# Altium schematic sheet [03] - AMG.SchDoc
size Letter
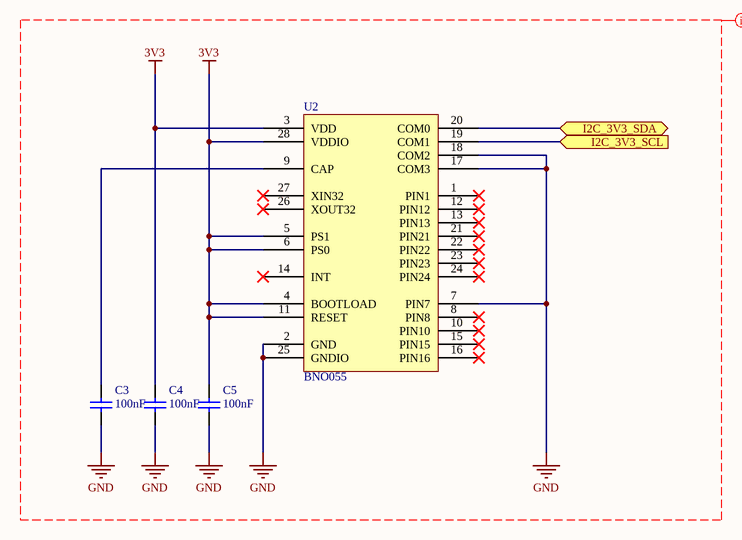
[diagram p0: [03] - AMG.SchDoc]

## Parts
C3  value 100nF  [CAPC0603(1608)100_L]  (hidden comment: CAP 100nF 50V 0603(1608))
C4  value 100nF  [CAPC0603(1608)100_L]  (hidden comment: CAP 100nF 50V 0603(1608))
C5  value 100nF  [CAPC0603(1608)100_L]  (hidden comment: CAP 100nF 50V 0603(1608))
U2  BNO055  [BNO055]

## Ports
I2C_3V3_SCL (in), I2C_3V3_SDA (bidir)

## Nets
3V3: C4.2 C5.2 U2.3(VDD) U2.4(BOOTLOAD) U2.5(PS1) U2.6(PS0) U2.11(RESET) U2.28(VDDIO)
GND: C3.1 C4.1 C5.1 U2.2(GND) U2.7(PIN7) U2.17(COM3) U2.18(COM2) U2.25(GNDIO)
I2C_3V3_SCL: U2.19(COM1) ; port I2C_3V3_SCL
I2C_3V3_SDA: U2.20(COM0) ; port I2C_3V3_SDA
NetC3_2: C3.2 U2.9(CAP)

Not connected (* = marked no-connect by the designer): U2 1(PIN1)* 8(PIN8)* 10(PIN10)* 12(PIN12)* 13(PIN13)* 14(INT)* 15(PIN15)* 16(PIN16)* 21(PIN21)* 22(PIN22)* 23(PIN23)* 24(PIN24)* 26(XOUT32)* 27(XIN32)*

## Layout directives
net class IMU Sensor: 3V3, GND

## Library data of the parts
C3-C5 = CMP-1035-02592-1: CAP 100nF 50V ±10% 0603 (1608 Metric) Thickness 1mm SMD; Manufacturer Part Number: C0603C104K5RACAUTO; Case-EIA: 0603; Case-Metric: 1608; Max Thickness: 1 mm; Tolerance: ±10%; Technology: SMT; Rated Voltage: 50 V; Digi-key Part Number: 399-6856-1-ND